# Altium schematic sheet reset-switch.SchDoc
size Letter; CompanyName: Brinton Engineering, LLC; Address1: 3479 Edison Way; Address2: Menlo Park CA 94025; Address3: +1 (877) 778-8435; Address4: brintonengineering.com; Revision: 1; SheetNumber: 34; SheetTotal: 41
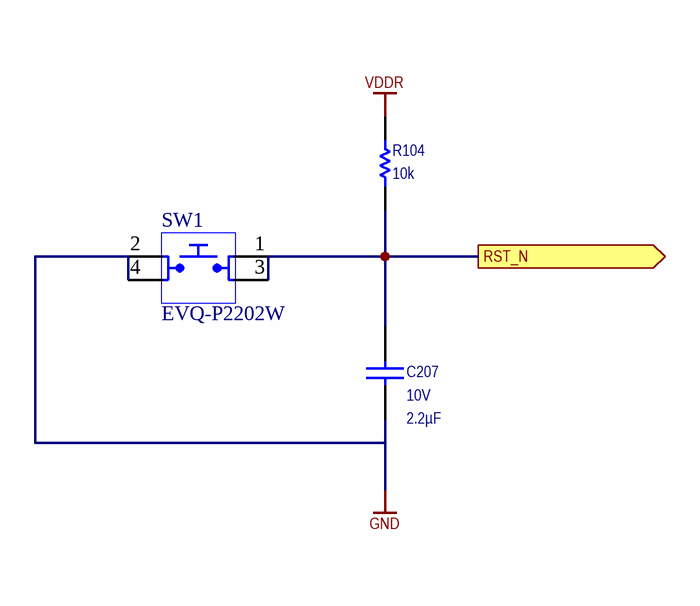
[diagram p0: reset-switch.SchDoc]

## Parts
C207  Voltage - Rated: 10V  Capacitance: 2.2µF  [CAPC1608X90N]  (hidden comment: GRM188R71A225KE15D)
R104  value 10k  [0603]  (hidden comment: ERJ-3EKF1002V)
SW1  value EVQ-P2202W  [EVQP2-2.5]  (hidden comment: Switch Tact SPST-NO 4.7x3.5mm SMT)

## Ports
RST_N (out)

## Nets
GND: C207.1 SW1.2 SW1.4
VDDR: R104.2
RST_N: C207.2 R104.1 SW1.1 SW1.3 ; port RST_N

## Notes on the sheet
- Title
- Engineer
- Revision
- Drawn By
- Checked By
- Date
- Sheet
- of

## Library data of the parts
C207 = GRM188R71A225KE15D: CAP CER 2.2UF 10V 10% X7R 0603; Manufacturer: Murata Electronics North America; Manufacturer P/N: GRM188R71A225KE15D; Operating Temperature: -55°C ~ 125°C; Thickness (Max): 0.035" (0.90mm); Tolerance: ±10%; Package / Case: 0603 (1608 Metric); Temperature Coefficient: X7R; Supplier 1: Newark; Supplier 2: Digi-Key; RoHS: RoHS Compliant; Size / Dimension: 0.063" L x 0.031" W (1.60mm x 0.80mm); Mounting Type: Surface Mount, MLCC; ComponentLink1URL: http://www.murata.com/~/media/webrenewal/support/library/catalog/products/capacitor/mlcc/c02e.ashx; ComponentLink1Description: http://www.murata.com/~/media/webrenewal/support/library/catalog/products/capacitor/mlcc/c02e.ashx; Supplier Part Number 1: 72R4209; Supplier Part Number 2: 490-4520-1-ND
R104 = RES 0603 10k 1%: Thick Film Resistor 10k Ohms +/-1% 0.1W SMD 0603; Manufacturer: Panasonic - ECG; Tcr: +/-100; Tr: -55:+155; Tolerance: +/-1%; Manufacturer P/N: ERJ-3EKF1002V; Alternatives: *; Power: 0.1W; P/N: ERJ-3EKF1002V
SW1 = EVQ-P2202W: Dist: Digi-Key; Dist P/N: P12299SCT-ND; Mfg: Panasonic; Price: 0.83; HelpURL: http://industrial.panasonic.com/www-data/pdf/ATK0000/ATK0000CE6.pdf; Mfgr P/N: EVQ-P2202W